# EAGLE design Mega_Shield-v13 (EAGLE 6.1)
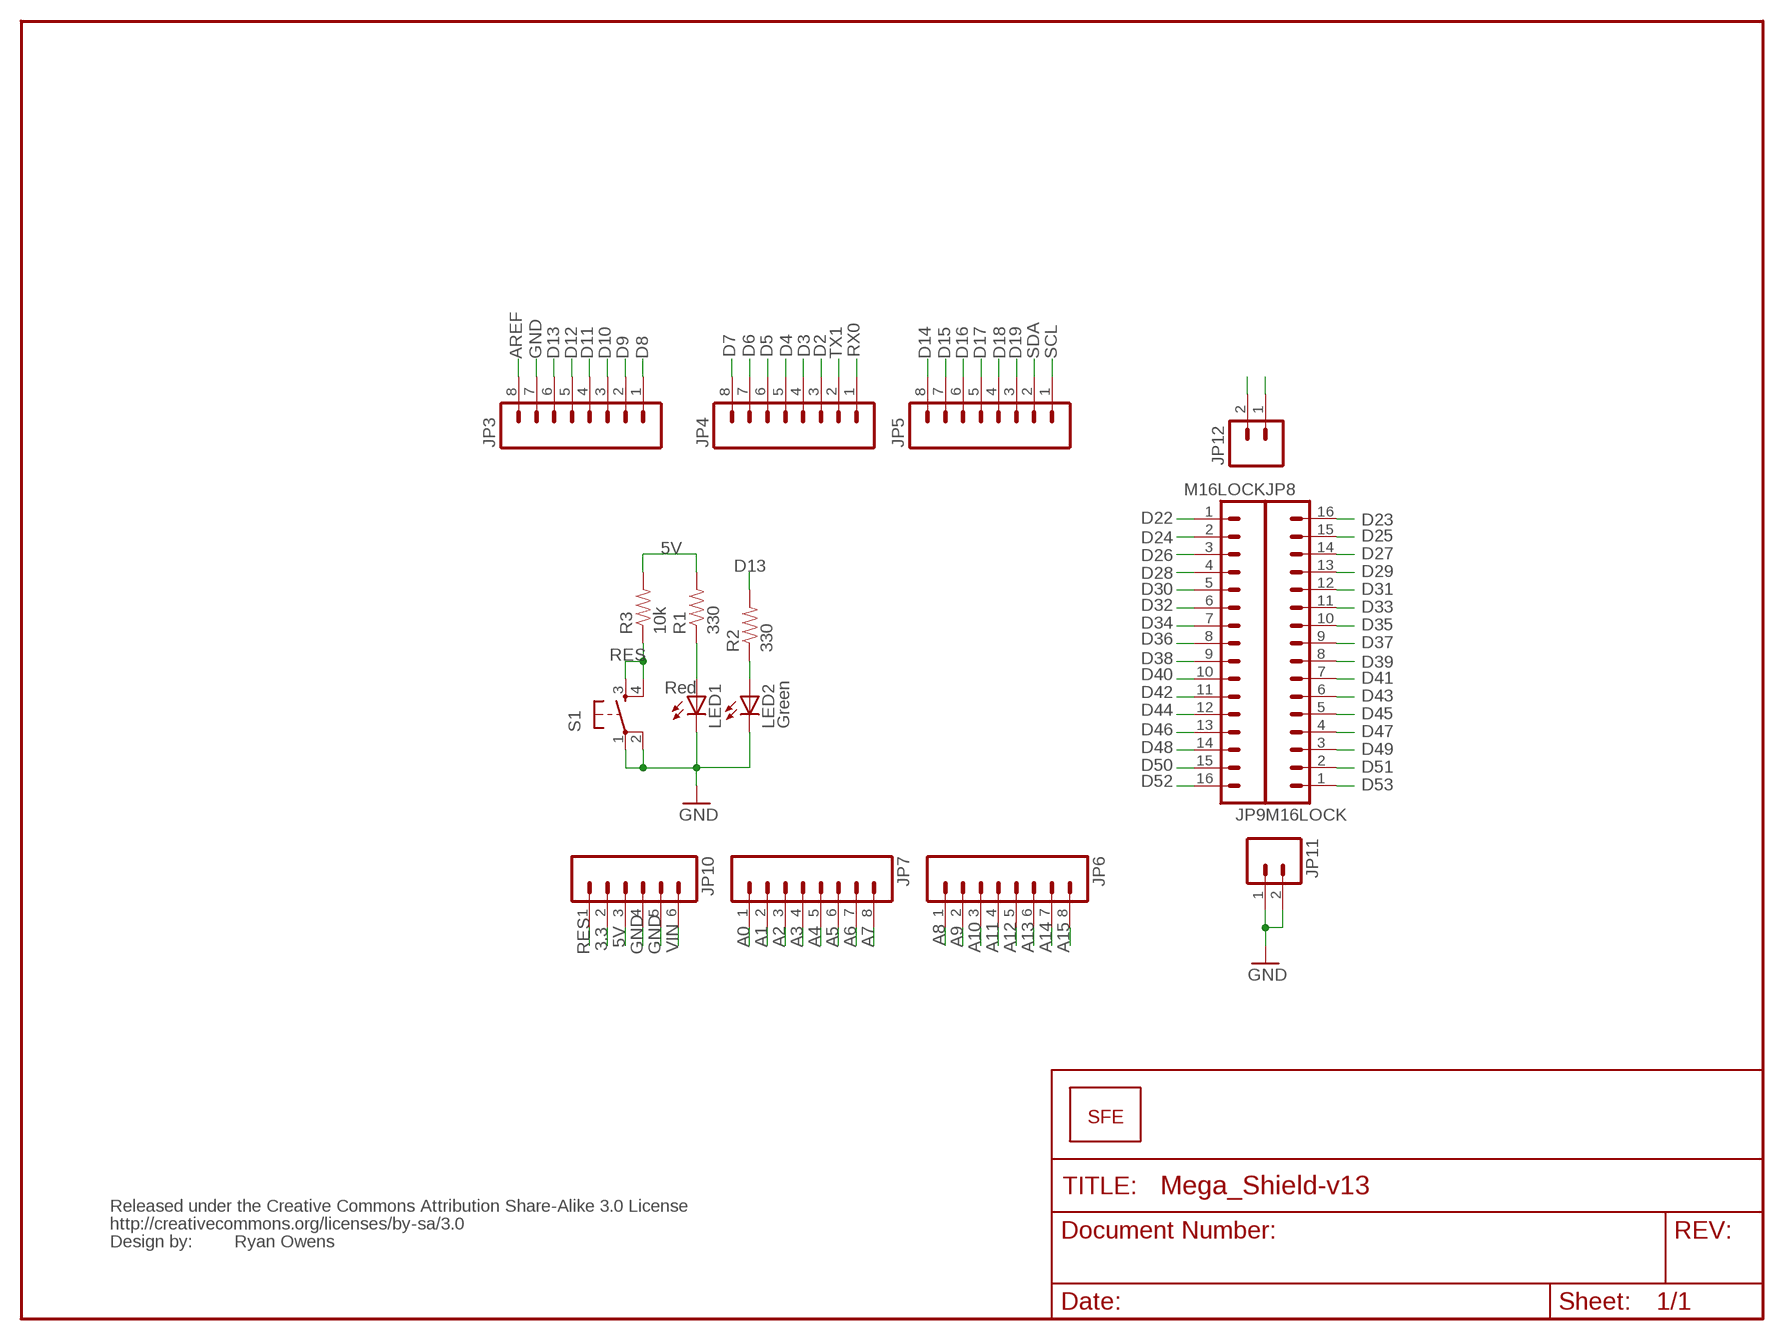
[diagram p0: schematic, sheet 1]

## Parts
JP3  M08LOCK  [1X08_LOCK]
JP4  M08LOCK  [1X08_LOCK]
JP5  M08LOCK  [1X08_LOCK]
JP6  M08LOCK  [1X08_LOCK]
JP7  M08LOCK  [1X08_LOCK]
JP8  M16LOCK  [1X16_LOCK]
JP9  M16LOCK  [1X16_LOCK]
JP10  M06LOCK  [1X06_LOCK]
JP11  M02LOCK  [1X02_LOCK]
JP12  M02LOCK  [1X02_LOCK]
LED1  Red  LED5MM  [LED5MM]
LED2  Green  LED5MM  [LED5MM]
R1  330  RESISTORPTH1  [AXIAL-0.3]
R2  330  RESISTORPTH1  [AXIAL-0.3]
R3  10k  RESISTORPTH1  [AXIAL-0.3]
S1  TAC_SWITCHPTH  [TACTILE-PTH]
U$1  LOGO-SFENEW  [SFE-NEW-WEBLOGO]
U$2  CREATIVE_COMMONS  [CREATIVE_COMMONS]

## Nets
3.3: JP10.2
5V: JP10.3 R1.P$2 R3.P$2
5V@1: JP12.1 JP12.2
A0: JP7.1
A1: JP7.2
A2: JP7.3
A3: JP7.4
A4: JP7.5
A5: JP7.6
A6: JP7.7
A7: JP7.8
A8: JP6.1
A9: JP6.2
A10: JP6.3
A11: JP6.4
A12: JP6.5
A13: JP6.6
A14: JP6.7
A15: JP6.8
AREF: JP3.8
D2: JP4.3
D3: JP4.4
D4: JP4.5
D5: JP4.6
D6: JP4.7
D7: JP4.8
D8: JP3.1
D9: JP3.2
D10: JP3.3
D11: JP3.4
D12: JP3.5
D13: JP3.6 R2.P$2
D14: JP5.8
D15: JP5.7
D16: JP5.6
D17: JP5.5
D18: JP5.4
D19: JP5.3
D22: JP9.1
D23: JP8.16
D24: JP9.2
D25: JP8.15
D26: JP9.3
D27: JP8.14
D28: JP9.4
D29: JP8.13
D30: JP9.5
D31: JP8.12
D32: JP9.6
D33: JP8.11
D34: JP9.7
D35: JP8.10
D36: JP9.8
D37: JP8.9
D38: JP9.9
D39: JP8.8
D40: JP9.10
D41: JP8.7
D42: JP9.11
D43: JP8.6
D44: JP9.12
D45: JP8.5
D46: JP9.13
D47: JP8.4
D48: JP9.14
D49: JP8.3
D50: JP9.15
D51: JP8.2
D52: JP9.16
D53: JP8.1
GND: JP3.7 JP10.4 JP10.5 JP11.1 JP11.2 LED1.K(C) LED2.K(C) S1.1 S1.2
N$126: LED1.A R1.P$1
N$127: LED2.A R2.P$1
RES: JP10.1 R3.P$1 S1.3 S1.4
RX0: JP4.1
SCL: JP5.1
SDA: JP5.2
TX1: JP4.2
VIN: JP10.6

## Notes on the sheet
- Ryan Owens

## Library data of the parts
JP3-JP7 = SparkFun:M08: Header 8 Standard 8-pin 0.1" header. Use with straight break away headers (SKU : PRT-00116), right angle break away headers (PRT-00553), swiss pins (PRT-00743), machine pins (PRT-00117), and female headers (PRT-00115).
JP8 JP9 = SparkFun:M16
JP10 = SparkFun:M06: Header 6 Standard 6-pin 0.1" header. Use with straight break away headers (SKU : PRT-00116), right angle break away headers (PRT-00553), swiss pins (PRT-00743), machine pins (PRT-00117), and female headers (PRT-00115). Molex polarized connector foot print use with SKU : PRT-08094 with associated crimp pins and housings. NOTES ON THE VARIANTS LOCK and LOCK_LONGPADS... This footprint was designed to help hold the alignment of a through-hole component (i.e. 6-pin header) while soldering it into place. You may notice that each hole has been shifted either up or down by 0.005 of an inch from it's more standard position (which is a perfectly straight line). This slight alteration caused the pins (the squares in the middle) to touch the edges of the holes. Because they are alternating, it causes a "brace" to hold the component in place. 0.005 has proven to be the perfect amount of "off-center" position when using our standard breakaway headers. Although looks a little odd when you look at the bare footprint, once you have a header in there, the alteration is very hard to notice. Also, if you push a header all the way into place, it is covered up entirely on the bottom side. This idea of altering the position of holes to aid alignment will be further integrated into the Sparkfun Library for other footprints. It can help hold any component with 3 or more connection pins.
JP11 JP12 = SparkFun:M02: Header 2 Standard 2-pin 0.1" header. Use with straight break away headers (SKU : PRT-00116), right angle break away headers (PRT-00553), swiss pins (PRT-00743), machine pins (PRT-00117), and female headers (PRT-00115). Molex polarized connector foot print use with SKU : PRT-08233 with associated crimp pins and housings.
LED1 LED2 = SparkFun:LED: LEDs Standard schematic elements and footprints for 5mm, 3mm, 1206, and 0603 sized LEDs. 5mm - Spark Fun Electronics SKU : COM-00529 (and others)
R1-R3 = SparkFun:RESISTOR: Resistor Basic schematic elements and footprints for 0603, 1206, and PTH 1/10th watt (small) resistors.
S1 = SparkFun:TAC_SWITCH: Momentary Switch Button commonly used for reset or general input. Spark Fun Electronics SKU : COM-00097
U$1 = SparkFun:LOGO-SFE: Spark Fun Electronics PCB Logo This is the standard Spark Fun Electronics PCB logo.
U$2 = SparkFun:CREATIVE_COMMONS

## Board
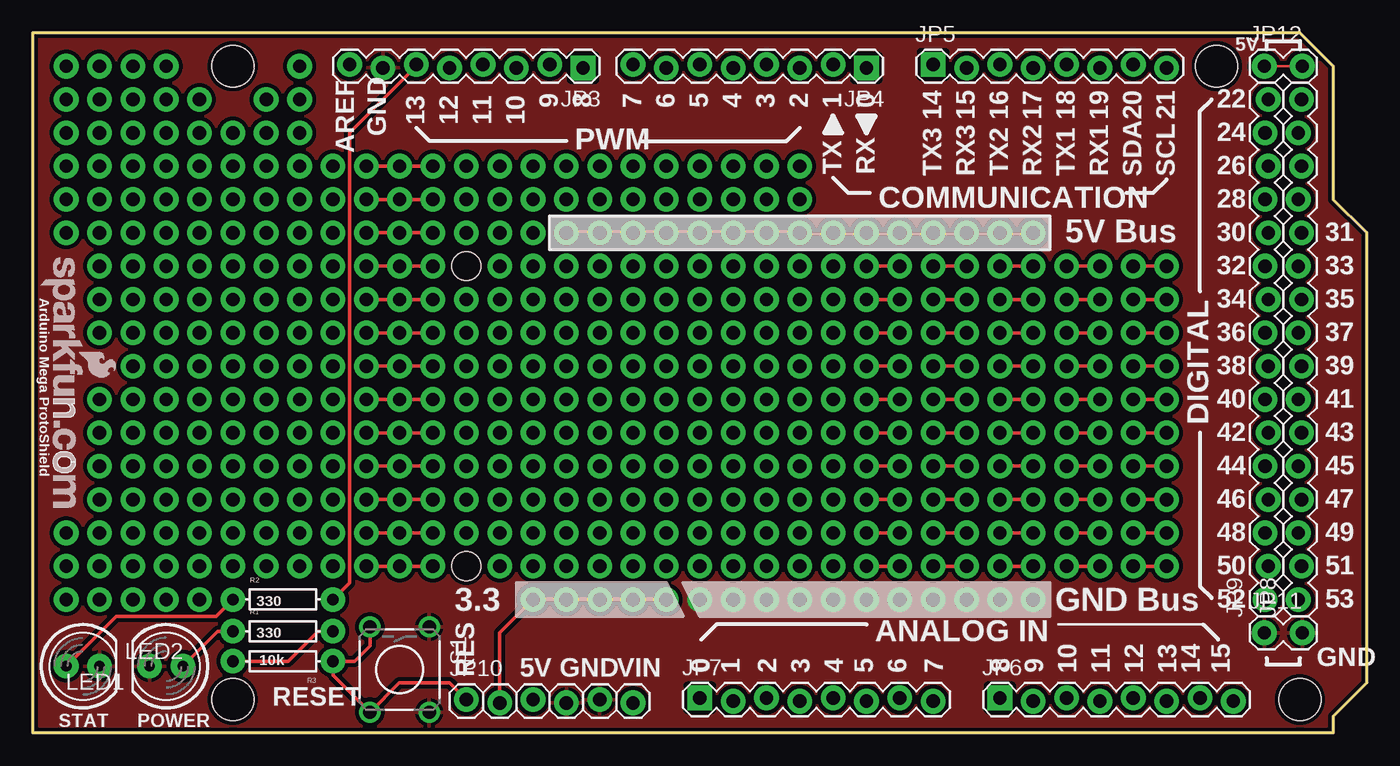
[diagram p1: board, top side]
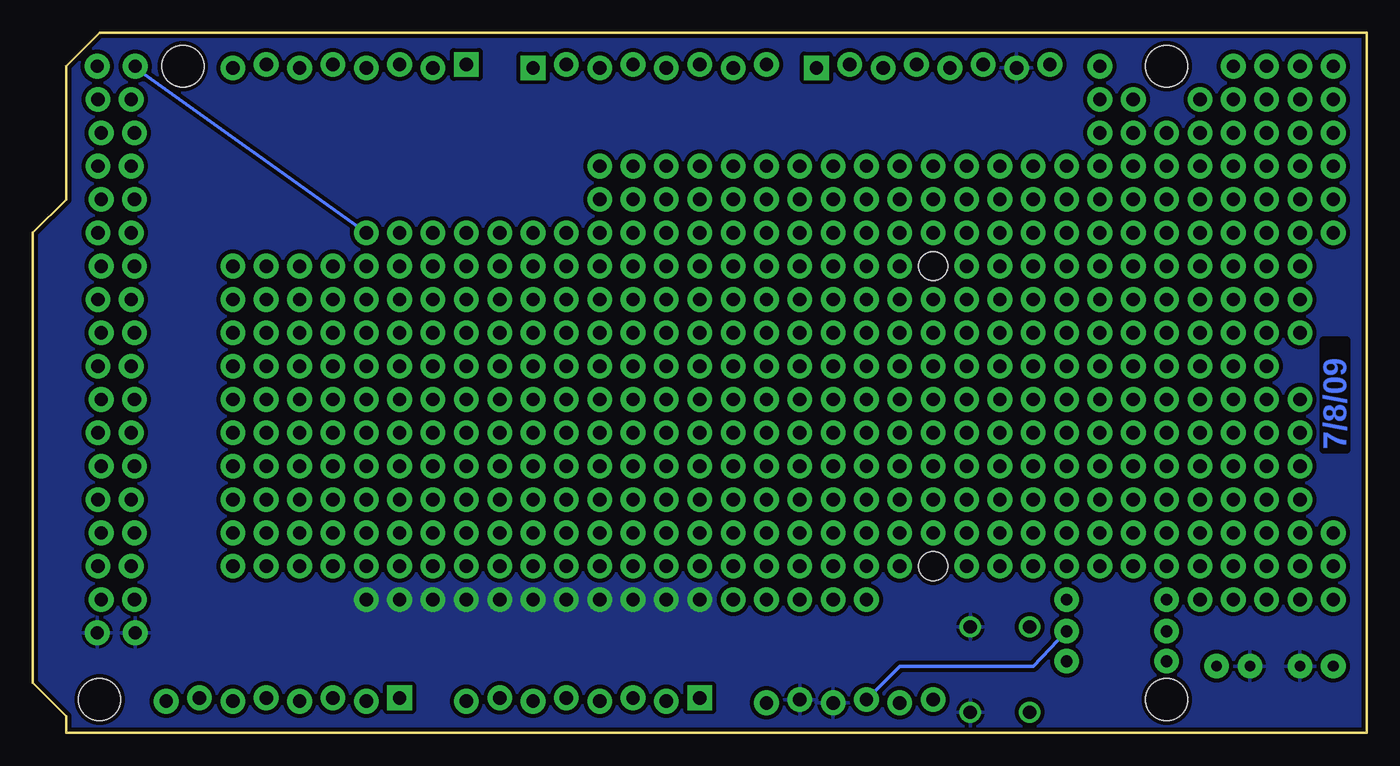
[diagram p2: board, bottom side, seen from below]

Size 101.6 x 53.34 mm. Coordinates in mm from the lower left corner, seen from the top.
Outline: 0,0 99.06,0 99.06,1.27 101.6,3.81 101.6,38.1 99.06,40.64 99.06,50.8 96.52,53.34 0,53.34 0,0
Copper layers (1*16): Top 0.035mm / dielectric 1.5mm / Bottom 0.035mm
Design rules: minimum track width 8mil, minimum drill 20mil, track to track 8mil, track to pad 8mil, pad to pad 8mil, via to via 8mil, smd to smd 8mil, copper to edge 10mil, drill to drill 8mil, minimum pad ring 12mil, minimum via ring 10mil, stop-mask expansion 4mil, vias tented up to drill 25mil, thermal gap 10mil
Holes 3.2 mm at 15.24,50.8 15.24,2.54 90.17,50.8 96.52,2.54
Holes 2.2 mm at 33.02,12.7 33.02,35.56

### Footprints (pad centres in the part's own frame; a part is rotated, then mirrored left to right if it is on the bottom)
1X08_LOCK = drill 1.016 pad 1.88 square: 1 0,0.127 | drill 1.016 pad 1.88: 2 2.54,-0.127; 3 5.08,0.127; 4 7.62,-0.127; 5 10.16,0.127; 6 12.7,-0.127; 7 15.24,0.127; 8 17.78,-0.127
1X16_LOCK = drill 1.016 pad 1.88: 1 0,0.127; 2 2.54,-0.127; 3 5.08,0.127; 4 7.62,-0.127; 5 10.16,0.127; 6 12.7,-0.127; 7 15.24,0.127; 8 17.78,-0.127; 9 20.32,0.127; 10 22.86,-0.127; 11 25.4,0.127; 12 27.94,-0.127; 13 30.48,0.127; 14 33.02,-0.127; 15 35.56,0.127; 16 38.1,-0.127
1X06_LOCK = drill 1.016 pad 1.88: 1 0,0; 2 2.54,-0.254; 3 5.08,0; 4 7.62,-0.254; 5 10.16,0; 6 12.7,-0.254
1X02_LOCK = drill 1.016 pad 1.88: 1 -0.178,0; 2 2.718,0
LED5MM = drill 0.813 pad 1.88: A -1.27,0; K 1.27,0
AXIAL-0.3 = drill 0.9 pad 1.88: P$1 -3.81,0; P$2 3.81,0
TACTILE-PTH = drill 1.016: 1 -3.251,2.261; 2 3.251,2.261; 3 -3.251,-2.261; 4 3.251,-2.261

### Placement (x,y rotation side)
JP3  41.91,50.8 180 top
JP4  63.5,50.8 180 top
JP5  68.58,50.8 0 top
JP6  73.66,2.54 0 top
JP7  50.8,2.54 0 top
JP8  96.52,10.16 90 top
JP9  93.98,10.16 90 top
JP10  33.02,2.54 0 top
JP11  93.98,7.62 0 top
JP12  93.98,50.8 0 top
LED1  10.16,5.08 180 top
LED2  3.81,5.08 0 top
R1  19.05,7.75 0 top
R2  19.05,10.16 0 top
R3  19.05,5.46 180 top
S1  27.94,4.83 270 top
U$1  0.64,36.2 270 top
U$2  20.32,-7.62 0 top  (outside the outline)

### Tracks (layer width: path | path; a pad name or v marks a point on that pad's centre or on a via)
3.3  (via drill 1.02 pad 1.88)
  Top 0.203: JP10.2 35.56,2.54
  Top 0.254: 35.56,2.54 35.56,7.62 v38.1,10.16 v40.64,10.16 v43.18,10.16 v45.72,10.16 v48.26,10.16
5V
  Top 0.254: R3.P$2 19.43,5.46 21.72,7.75 R1.P$2
  Bottom 0.254: R1.P$2 25.4,5.08 35.56,5.08 JP10.3
5V@1  (via drill 1.02 pad 1.88)
  Top 0.203: v76.2,38.1 76.2,38 73.76,38 v73.66,38.1 73.56,38 71.12,38 | 66.04,38 63.6,38 v63.5,38.1 63.4,38 60.96,38 | 66.04,38 68.48,38 v68.58,38.1 68.68,38 71.12,38 | 66.04,38 v66.04,38.1 | 71.12,38 v71.12,38.1 | v40.64,38.1 40.64,38.2 43.08,38.2 v43.18,38.1 43.28,38.2 45.72,38.2 | 50.8,38.2 48.36,38.2 v48.26,38.1 48.16,38.2 45.72,38.2 | 50.8,38.2 53.24,38.2 v53.34,38.1 53.44,38.2 55.88,38.2 | 50.8,38.2 v50.8,38.1 | 55.88,38.2 58.32,38.2 v58.42,38.1 58.52,38 60.96,38 | 55.88,38.2 v55.88,38.1 | 45.72,38.2 v45.72,38.1 | 60.96,38 v60.96,38.1 | JP12.2 JP12.1
  Bottom 0.203: JP12.1 93.88,50.8 93.91,50.75
  Bottom 0.254: v76.2,38.1 93.91,50.75 93.98,50.8
A0
  Top 0.203: JP7.1 50.8,2.54
A1
  Top 0.203: JP7.2 53.34,2.54
A2
  Top 0.203: JP7.3 55.88,2.54
A3
  Top 0.203: JP7.4 58.42,2.54
A4
  Top 0.203: JP7.5 60.96,2.54
A5
  Top 0.203: JP7.6 63.5,2.54
A6
  Top 0.203: JP7.7 66.04,2.54
A7
  Top 0.203: JP7.8 68.58,2.54
A8
  Top 0.203: JP6.1 73.66,2.54
A9
  Top 0.203: JP6.2 76.2,2.54
A10
  Top 0.203: JP6.3 78.74,2.54
A11
  Top 0.203: JP6.4 81.28,2.54
A12
  Top 0.203: JP6.5 83.82,2.54
A13
  Top 0.203: JP6.6 86.36,2.54
A14
  Top 0.203: JP6.7 88.9,2.54
A15
  Top 0.203: JP6.8 91.44,2.54
AREF
  Top 0.203: JP3.8 24.13,50.8
D2
  Top 0.203: JP4.3 58.42,50.8
D3
  Top 0.203: JP4.4 55.88,50.8
D4
  Top 0.203: JP4.5 53.34,50.8
D5
  Top 0.203: JP4.6 50.8,50.8
D6
  Top 0.203: JP4.7 48.26,50.8
D7
  Top 0.203: JP4.8 45.72,50.8
D8
  Top 0.203: JP3.1 41.91,50.8
D9
  Top 0.203: JP3.2 39.37,50.8
D10
  Top 0.203: JP3.3 36.83,50.8
D11
  Top 0.203: JP3.4 34.29,50.8
D12
  Top 0.203: JP3.5 31.75,50.8
D13
  Top 0.254: R2.P$2 24.13,11.43 24.13,45.72 29.21,50.8 JP3.6
D14
  Top 0.203: JP5.8 86.36,50.8
D15
  Top 0.203: JP5.7 83.82,50.8
D16
  Top 0.203: JP5.6 81.28,50.8
D17
  Top 0.203: JP5.5 78.74,50.8
D18
  Top 0.203: JP5.4 76.2,50.8
D19
  Top 0.203: JP5.3 73.66,50.8
GND  (via drill 1.02 pad 1.88)
  other vias: 76.2,10.16 73.66,10.16 71.12,10.16 68.58,10.16 66.04,10.16 63.5,10.16 60.96,10.16 58.42,10.16 55.88,10.16 53.34,10.16 50.8,10.16
  pour Bottom (isolate 0.305): 0,0 99.06,0 99.06,1.27 101.6,3.81 101.6,38.1 99.06,40.64 99.06,50.8 96.52,53.34 0,53.34 0,2.54
  pour Top (isolate 0.305): 0,0 99.06,0 99.06,1.27 101.6,3.81 101.6,38.1 99.06,40.64 99.06,50.8 96.52,53.34 0,53.34 0,2.54
N$1  (via drill 1.02 pad 1.88)
  other vias: 2.54,38.1
N$2  (via drill 1.02 pad 1.88)
  Top 0.254: v86.36,35.56 v83.82,35.56
N$3  (via drill 1.02 pad 1.88)
  Top 0.254: v86.36,33.02 v83.82,33.02
N$4  (via drill 1.02 pad 1.88)
  other vias: 2.54,40.64
N$5  (via drill 1.02 pad 1.88)
  Top 0.254: v86.36,27.94 v83.82,27.94
N$6  (via drill 1.02 pad 1.88)
  other vias: 5.08,40.64
N$7  (via drill 1.02 pad 1.88)
  Top 0.254: v86.36,22.86 v83.82,22.86
N$8  (via drill 1.02 pad 1.88)
  other vias: 7.62,40.64
N$9  (via drill 1.02 pad 1.88)
  Top 0.254: v86.36,17.78 v83.82,17.78
N$10  (via drill 1.02 pad 1.88)
  other vias: 5.08,38.1
N$11  (via drill 1.02 pad 1.88)
  Top 0.254: v86.36,12.7 v83.82,12.7
N$12  (via drill 1.02 pad 1.88)
  Top 0.254: v30.48,12.7 v27.94,12.7 v25.4,12.7
N$13  (via drill 1.02 pad 1.88)
  other vias: 2.54,10.16
N$14  (via drill 1.02 pad 1.88)
  other vias: 7.62,38.1
N$15  (via drill 1.02 pad 1.88)
  other vias: 10.16,38.1
N$16  (via drill 1.02 pad 1.88)
  Top 0.254: v83.82,30.48 v86.36,30.48
N$17  (via drill 1.02 pad 1.88)
  other vias: 12.7,38.1
N$18  (via drill 1.02 pad 1.88)
  Top 0.254: v83.82,25.4 v86.36,25.4
N$19  (via drill 1.02 pad 1.88)
  other vias: 15.24,38.1
N$20  (via drill 1.02 pad 1.88)
  Top 0.254: v83.82,20.32 v86.36,20.32
N$21  (via drill 1.02 pad 1.88)
  other vias: 17.78,38.1
N$22  (via drill 1.02 pad 1.88)
  Top 0.254: v83.82,15.24 v86.36,15.24
N$23  (via drill 1.02 pad 1.88)
  other vias: 20.32,38.1
N$24  (via drill 1.02 pad 1.88)
  other vias: 5.08,10.16
N$25  (via drill 1.02 pad 1.88)
  other vias: 7.62,10.16
N$26  (via drill 1.02 pad 1.88)
  Top 0.254: v81.28,12.7 v78.74,12.7
N$27  (via drill 1.02 pad 1.88)
  Top 0.254: v81.28,15.24 v78.74,15.24
N$28  (via drill 1.02 pad 1.88)
  Top 0.254: v81.28,17.78 v78.74,17.78
N$29  (via drill 1.02 pad 1.88)
  Top 0.254: v81.28,20.32 v78.74,20.32
N$30  (via drill 1.02 pad 1.88)
  Top 0.254: v81.28,22.86 v78.74,22.86
N$31  (via drill 1.02 pad 1.88)
  Top 0.254: v81.28,25.4 v78.74,25.4
N$32  (via drill 1.02 pad 1.88)
  Top 0.254: v81.28,27.94 v78.74,27.94
N$33  (via drill 1.02 pad 1.88)
  Top 0.254: v81.28,30.48 v78.74,30.48
N$34  (via drill 1.02 pad 1.88)
  Top 0.254: v81.28,33.02 v78.74,33.02
N$35  (via drill 1.02 pad 1.88)
  Top 0.254: v81.28,35.56 v78.74,35.56
N$36  (via drill 1.02 pad 1.88)
  other vias: 10.16,10.16
N$37  (via drill 1.02 pad 1.88)
  other vias: 12.7,10.16
N$38  (via drill 1.02 pad 1.88)
  other vias: 22.86,38.1
N$39  (via drill 1.02 pad 1.88)
  Top 0.254: v25.4,38.1 v27.94,38.1 v30.48,38.1
N$42  (via drill 1.02 pad 1.88)
  other vias: 33.02,38.1
N$43  (via drill 1.02 pad 1.88)
  other vias: 35.56,38.1
N$44  (via drill 1.02 pad 1.88)
  other vias: 38.1,38.1
N$45  (via drill 1.02 pad 1.88)
  other vias: 45.72,35.56
N$46  (via drill 1.02 pad 1.88)
  other vias: 48.26,35.56
N$47  (via drill 1.02 pad 1.88)
  other vias: 50.8,35.56
N$48  (via drill 1.02 pad 1.88)
  other vias: 53.34,35.56
N$49  (via drill 1.02 pad 1.88)
  other vias: 55.88,35.56
N$50  (via drill 1.02 pad 1.88)
  Top 0.254: v76.2,12.7 v73.66,12.7
N$51  (via drill 1.02 pad 1.88)
  Top 0.254: v76.2,15.24 v73.66,15.24
N$52  (via drill 1.02 pad 1.88)
  Top 0.254: v76.2,17.78 v73.66,17.78
N$53  (via drill 1.02 pad 1.88)
  Top 0.254: v76.2,20.32 v73.66,20.32
N$54  (via drill 1.02 pad 1.88)
  Top 0.254: v76.2,22.86 v73.66,22.86
N$55  (via drill 1.02 pad 1.88)
  Top 0.254: v76.2,25.4 v73.66,25.4
N$56  (via drill 1.02 pad 1.88)
  Top 0.254: v76.2,27.94 v73.66,27.94
N$57  (via drill 1.02 pad 1.88)
  Top 0.254: v76.2,30.48 v73.66,30.48
N$58  (via drill 1.02 pad 1.88)
  Top 0.254: v76.2,33.02 v73.66,33.02
N$59  (via drill 1.02 pad 1.88)
  other vias: 58.42,35.56
N$60  (via drill 1.02 pad 1.88)
  other vias: 60.96,35.56
N$61  (via drill 1.02 pad 1.88)
  other vias: 35.56,12.7
N$62  (via drill 1.02 pad 1.88)
  Top 0.254: v66.04,35.56 v63.5,35.56
N$64  (via drill 1.02 pad 1.88)
  Top 0.254: v71.12,35.56 v68.58,35.56
N$66  (via drill 1.02 pad 1.88)
  Top 0.254: v76.2,35.56 v73.66,35.56
N$74  (via drill 1.02 pad 1.88)
  Top 0.254: v71.12,12.7 v68.58,12.7
N$76  (via drill 1.02 pad 1.88)
  Top 0.254: v71.12,17.78 v68.58,17.78
N$78  (via drill 1.02 pad 1.88)
  Top 0.254: v71.12,22.86 v68.58,22.86
N$80  (via drill 1.02 pad 1.88)
  Top 0.254: v71.12,27.94 v68.58,27.94
N$82  (via drill 1.02 pad 1.88)
  Top 0.254: v71.12,33.02 v68.58,33.02
N$88  (via drill 1.02 pad 1.88)
  Top 0.254: v68.58,30.48 v71.12,30.48
N$90  (via drill 1.02 pad 1.88)
  Top 0.254: v68.58,25.4 v71.12,25.4
N$92  (via drill 1.02 pad 1.88)
  Top 0.254: v68.58,20.32 v71.12,20.32
N$94  (via drill 1.02 pad 1.88)
  Top 0.254: v68.58,15.24 v71.12,15.24
N$98  (via drill 1.02 pad 1.88)
  Top 0.254: v66.04,12.7 v63.5,12.7
N$100  (via drill 1.02 pad 1.88)
  Top 0.254: v66.04,17.78 v63.5,17.78
N$102  (via drill 1.02 pad 1.88)
  Top 0.254: v66.04,22.86 v63.5,22.86
N$104  (via drill 1.02 pad 1.88)
  Top 0.254: v66.04,27.94 v63.5,27.94
N$106  (via drill 1.02 pad 1.88)
  Top 0.254: v66.04,33.02 v63.5,33.02
N$112  (via drill 1.02 pad 1.88)
  Top 0.254: v63.5,30.48 v66.04,30.48
N$114  (via drill 1.02 pad 1.88)
  Top 0.254: v63.5,25.4 v66.04,25.4
N$116  (via drill 1.02 pad 1.88)
  Top 0.254: v63.5,20.32 v66.04,20.32
N$118  (via drill 1.02 pad 1.88)
  Top 0.254: v63.5,15.24 v66.04,15.24
N$122  (via drill 1.02 pad 1.88)
  other vias: 60.96,12.7
N$123  (via drill 1.02 pad 1.88)
  other vias: 60.96,15.24
N$124  (via drill 1.02 pad 1.88)
  other vias: 60.96,17.78
N$126
  Top 0.254: R1.P$1 14.1,7.75 LED1.A
N$127
  Top 0.254: R2.P$1 13.97,8.89 6.35,8.89 LED2.A
N$128  (via drill 1.02 pad 1.88)
  other vias: 60.96,20.32
N$129  (via drill 1.02 pad 1.88)
  other vias: 60.96,22.86
N$130  (via drill 1.02 pad 1.88)
  other vias: 60.96,25.4
N$131  (via drill 1.02 pad 1.88)
  other vias: 60.96,27.94
N$132  (via drill 1.02 pad 1.88)
  other vias: 60.96,30.48
N$133  (via drill 1.02 pad 1.88)
  other vias: 60.96,33.02
N$136  (via drill 1.02 pad 1.88)
  other vias: 58.42,43.18
N$137  (via drill 1.02 pad 1.88)
  other vias: 58.42,40.64
N$140  (via drill 1.02 pad 1.88)
  other vias: 58.42,33.02
N$141  (via drill 1.02 pad 1.88)
  other vias: 58.42,30.48
N$142  (via drill 1.02 pad 1.88)
  other vias: 58.42,27.94
N$143  (via drill 1.02 pad 1.88)
  other vias: 58.42,25.4
N$144  (via drill 1.02 pad 1.88)
  other vias: 58.42,22.86
N$145  (via drill 1.02 pad 1.88)
  other vias: 58.42,20.32
N$146  (via drill 1.02 pad 1.88)
  other vias: 58.42,17.78
N$147  (via drill 1.02 pad 1.88)
  other vias: 58.42,15.24
N$148  (via drill 1.02 pad 1.88)
  other vias: 58.42,12.7
N$151  (via drill 1.02 pad 1.88)
  other vias: 55.88,12.7
N$152  (via drill 1.02 pad 1.88)
  other vias: 55.88,15.24
N$153  (via drill 1.02 pad 1.88)
  other vias: 55.88,17.78
N$154  (via drill 1.02 pad 1.88)
  other vias: 55.88,20.32
N$155  (via drill 1.02 pad 1.88)
  other vias: 55.88,22.86
N$156  (via drill 1.02 pad 1.88)
  other vias: 55.88,25.4
N$157  (via drill 1.02 pad 1.88)
  other vias: 55.88,27.94
N$158  (via drill 1.02 pad 1.88)
  other vias: 55.88,30.48
N$159  (via drill 1.02 pad 1.88)
  other vias: 55.88,33.02
N$162  (via drill 1.02 pad 1.88)
  other vias: 55.88,40.64
N$163  (via drill 1.02 pad 1.88)
  other vias: 55.88,43.18
N$164  (via drill 1.02 pad 1.88)
  other vias: 53.34,43.18
N$165  (via drill 1.02 pad 1.88)
  other vias: 53.34,40.64
N$168  (via drill 1.02 pad 1.88)
  other vias: 53.34,33.02
N$169  (via drill 1.02 pad 1.88)
  other vias: 53.34,30.48
N$170  (via drill 1.02 pad 1.88)
  other vias: 53.34,27.94
N$171  (via drill 1.02 pad 1.88)
  other vias: 53.34,25.4
N$172  (via drill 1.02 pad 1.88)
  other vias: 53.34,22.86
N$173  (via drill 1.02 pad 1.88)
  other vias: 53.34,20.32
N$174  (via drill 1.02 pad 1.88)
  other vias: 53.34,17.78
N$175  (via drill 1.02 pad 1.88)
  other vias: 53.34,15.24
N$176  (via drill 1.02 pad 1.88)
  other vias: 53.34,12.7
N$179  (via drill 1.02 pad 1.88)
  other vias: 50.8,12.7
N$180  (via drill 1.02 pad 1.88)
  other vias: 50.8,15.24
N$181  (via drill 1.02 pad 1.88)
  other vias: 50.8,17.78
N$182  (via drill 1.02 pad 1.88)
  other vias: 50.8,20.32
N$183  (via drill 1.02 pad 1.88)
  other vias: 50.8,22.86
N$184  (via drill 1.02 pad 1.88)
  other vias: 50.8,25.4
N$185  (via drill 1.02 pad 1.88)
  other vias: 50.8,27.94
N$186  (via drill 1.02 pad 1.88)
  other vias: 50.8,30.48
N$187  (via drill 1.02 pad 1.88)
  other vias: 50.8,33.02
N$190  (via drill 1.02 pad 1.88)
  other vias: 50.8,40.64
N$191  (via drill 1.02 pad 1.88)
  other vias: 50.8,43.18
N$192  (via drill 1.02 pad 1.88)
  other vias: 48.26,43.18
N$193  (via drill 1.02 pad 1.88)
  other vias: 48.26,40.64
N$196  (via drill 1.02 pad 1.88)
  other vias: 48.26,33.02
N$197  (via drill 1.02 pad 1.88)
  other vias: 48.26,30.48
N$198  (via drill 1.02 pad 1.88)
  other vias: 48.26,27.94
N$199  (via drill 1.02 pad 1.88)
  other vias: 48.26,25.4
N$200  (via drill 1.02 pad 1.88)
  other vias: 48.26,22.86
N$201  (via drill 1.02 pad 1.88)
  other vias: 48.26,20.32
N$202  (via drill 1.02 pad 1.88)
  other vias: 48.26,17.78
N$203  (via drill 1.02 pad 1.88)
  other vias: 48.26,15.24
N$204  (via drill 1.02 pad 1.88)
  other vias: 48.26,12.7
N$207  (via drill 1.02 pad 1.88)
  other vias: 45.72,12.7
N$208  (via drill 1.02 pad 1.88)
  other vias: 45.72,15.24
N$209  (via drill 1.02 pad 1.88)
  other vias: 45.72,17.78
N$210  (via drill 1.02 pad 1.88)
  other vias: 45.72,20.32
N$211  (via drill 1.02 pad 1.88)
  other vias: 45.72,22.86
N$212  (via drill 1.02 pad 1.88)
  other vias: 45.72,25.4
N$213  (via drill 1.02 pad 1.88)
  other vias: 45.72,27.94
N$214  (via drill 1.02 pad 1.88)
  other vias: 45.72,30.48
N$215  (via drill 1.02 pad 1.88)
  other vias: 45.72,33.02
N$218  (via drill 1.02 pad 1.88)
  other vias: 45.72,40.64
N$219  (via drill 1.02 pad 1.88)
  other vias: 45.72,43.18
N$220  (via drill 1.02 pad 1.88)
  other vias: 43.18,43.18
N$221  (via drill 1.02 pad 1.88)
  other vias: 43.18,40.64
N$223  (via drill 1.02 pad 1.88)
  other vias: 43.18,35.56
N$224  (via drill 1.02 pad 1.88)
  other vias: 43.18,33.02
N$225  (via drill 1.02 pad 1.88)
  other vias: 43.18,30.48
N$226  (via drill 1.02 pad 1.88)
  other vias: 43.18,27.94
N$227  (via drill 1.02 pad 1.88)
  other vias: 43.18,25.4
N$228  (via drill 1.02 pad 1.88)
  other vias: 43.18,22.86
N$229  (via drill 1.02 pad 1.88)
  other vias: 43.18,20.32
N$230  (via drill 1.02 pad 1.88)
  other vias: 43.18,17.78
N$231  (via drill 1.02 pad 1.88)
  other vias: 43.18,15.24
N$232  (via drill 1.02 pad 1.88)
  other vias: 43.18,12.7
N$235  (via drill 1.02 pad 1.88)
  other vias: 40.64,12.7
N$236  (via drill 1.02 pad 1.88)
  other vias: 40.64,15.24
N$237  (via drill 1.02 pad 1.88)
  other vias: 40.64,17.78
N$238  (via drill 1.02 pad 1.88)
  other vias: 40.64,20.32
N$239  (via drill 1.02 pad 1.88)
  other vias: 40.64,22.86
N$240  (via drill 1.02 pad 1.88)
  other vias: 40.64,25.4
N$241  (via drill 1.02 pad 1.88)
  other vias: 40.64,27.94
N$242  (via drill 1.02 pad 1.88)
  other vias: 40.64,30.48
N$243  (via drill 1.02 pad 1.88)
  other vias: 40.64,33.02
N$244  (via drill 1.02 pad 1.88)
  other vias: 40.64,35.56
N$246  (via drill 1.02 pad 1.88)
  other vias: 40.64,40.64
N$247  (via drill 1.02 pad 1.88)
  other vias: 40.64,43.18
N$248  (via drill 1.02 pad 1.88)
  other vias: 38.1,43.18
N$249  (via drill 1.02 pad 1.88)
  other vias: 38.1,40.64
N$251  (via drill 1.02 pad 1.88)
  other vias: 38.1,35.56
N$252  (via drill 1.02 pad 1.88)
  other vias: 38.1,33.02
N$253  (via drill 1.02 pad 1.88)
  other vias: 38.1,30.48
N$254  (via drill 1.02 pad 1.88)
  other vias: 38.1,27.94
N$255  (via drill 1.02 pad 1.88)
  other vias: 38.1,25.4
N$256  (via drill 1.02 pad 1.88)
  other vias: 38.1,22.86
N$257  (via drill 1.02 pad 1.88)
  other vias: 38.1,20.32
N$258  (via drill 1.02 pad 1.88)
  other vias: 38.1,17.78
N$259  (via drill 1.02 pad 1.88)
  other vias: 38.1,15.24
N$260  (via drill 1.02 pad 1.88)
  other vias: 38.1,12.7
N$264  (via drill 1.02 pad 1.88)
  other vias: 35.56,15.24
N$265  (via drill 1.02 pad 1.88)
  other vias: 35.56,17.78
N$266  (via drill 1.02 pad 1.88)
  other vias: 35.56,20.32
N$267  (via drill 1.02 pad 1.88)
  other vias: 35.56,22.86
N$268  (via drill 1.02 pad 1.88)
  other vias: 35.56,25.4
N$269  (via drill 1.02 pad 1.88)
  other vias: 35.56,27.94
N$270  (via drill 1.02 pad 1.88)
  other vias: 35.56,30.48
N$271  (via drill 1.02 pad 1.88)
  other vias: 35.56,33.02
N$272  (via drill 1.02 pad 1.88)
  other vias: 35.56,35.56
N$274  (via drill 1.02 pad 1.88)
  other vias: 35.56,40.64
N$275  (via drill 1.02 pad 1.88)
  other vias: 35.56,43.18
N$276  (via drill 1.02 pad 1.88)
  other vias: 33.02,43.18
N$277  (via drill 1.02 pad 1.88)
  other vias: 33.02,40.64
N$280  (via drill 1.02 pad 1.88)
  other vias: 33.02,33.02
N$281  (via drill 1.02 pad 1.88)
  other vias: 33.02,30.48
N$282  (via drill 1.02 pad 1.88)
  other vias: 33.02,27.94
N$283  (via drill 1.02 pad 1.88)
  other vias: 33.02,22.86
N$284  (via drill 1.02 pad 1.88)
  other vias: 33.02,25.4
N$285  (via drill 1.02 pad 1.88)
  other vias: 33.02,20.32
N$286  (via drill 1.02 pad 1.88)
  other vias: 33.02,17.78
N$287  (via drill 1.02 pad 1.88)
  other vias: 33.02,15.24
N$293  (via drill 1.02 pad 1.88)
  Top 0.254: v30.48,17.78 v27.94,17.78 v25.4,17.78
N$295  (via drill 1.02 pad 1.88)
  Top 0.254: v30.48,22.86 v27.94,22.86 v25.4,22.86
N$297  (via drill 1.02 pad 1.88)
  Top 0.254: v30.48,27.94 v27.94,27.94 v25.4,27.94
N$326  (via drill 1.02 pad 1.88)
  Top 0.254: v25.4,43.18 v27.94,43.18 v30.48,43.18
N$327  (via drill 1.02 pad 1.88)
  Top 0.254: v25.4,40.64 v27.94,40.64 v30.48,40.64
N$329  (via drill 1.02 pad 1.88)
  Top 0.254: v25.4,35.56 v27.94,35.56 v30.48,35.56
N$330  (via drill 1.02 pad 1.88)
  Top 0.254: v25.4,33.02 v27.94,33.02 v30.48,33.02
N$331  (via drill 1.02 pad 1.88)
  Top 0.254: v25.4,30.48 v27.94,30.48 v30.48,30.48
N$333  (via drill 1.02 pad 1.88)
  Top 0.254: v25.4,25.4 v27.94,25.4 v30.48,25.4
N$335  (via drill 1.02 pad 1.88)
  Top 0.254: v25.4,20.32 v27.94,20.32 v30.48,20.32
N$337  (via drill 1.02 pad 1.88)
  Top 0.254: v25.4,15.24 v27.94,15.24 v30.48,15.24
N$343  (via drill 1.02 pad 1.88)
  other vias: 22.86,12.7
N$344  (via drill 1.02 pad 1.88)
  other vias: 22.86,15.24
N$345  (via drill 1.02 pad 1.88)
  other vias: 22.86,17.78
N$346  (via drill 1.02 pad 1.88)
  other vias: 22.86,20.32
N$347  (via drill 1.02 pad 1.88)
  other vias: 22.86,22.86
N$348  (via drill 1.02 pad 1.88)
  other vias: 22.86,25.4
N$349  (via drill 1.02 pad 1.88)
  other vias: 22.86,27.94
N$350  (via drill 1.02 pad 1.88)
  other vias: 22.86,30.48
N$351  (via drill 1.02 pad 1.88)
  other vias: 22.86,33.02
N$352  (via drill 1.02 pad 1.88)
  other vias: 22.86,35.56
N$354  (via drill 1.02 pad 1.88)
  other vias: 22.86,40.64
N$355  (via drill 1.02 pad 1.88)
  other vias: 22.86,43.18
N$356  (via drill 1.02 pad 1.88)
  other vias: 20.32,45.72
N$357  (via drill 1.02 pad 1.88)
  other vias: 20.32,48.26
N$358  (via drill 1.02 pad 1.88)
  other vias: 20.32,50.8
N$359  (via drill 1.02 pad 1.88)
  other vias: 20.32,43.18
N$360  (via drill 1.02 pad 1.88)
  other vias: 20.32,40.64
N$362  (via drill 1.02 pad 1.88)
  other vias: 20.32,35.56
N$363  (via drill 1.02 pad 1.88)
  other vias: 20.32,33.02
N$364  (via drill 1.02 pad 1.88)
  other vias: 20.32,30.48
N$365  (via drill 1.02 pad 1.88)
  other vias: 20.32,27.94
N$366  (via drill 1.02 pad 1.88)
  other vias: 20.32,22.86
N$367  (via drill 1.02 pad 1.88)
  other vias: 20.32,25.4
N$368  (via drill 1.02 pad 1.88)
  other vias: 20.32,20.32
N$369  (via drill 1.02 pad 1.88)
  other vias: 20.32,17.78
N$370  (via drill 1.02 pad 1.88)
  other vias: 20.32,15.24
N$371  (via drill 1.02 pad 1.88)
  other vias: 20.32,12.7
N$376  (via drill 1.02 pad 1.88)
  other vias: 17.78,12.7
N$377  (via drill 1.02 pad 1.88)
  other vias: 17.78,15.24
N$378  (via drill 1.02 pad 1.88)
  other vias: 17.78,17.78
N$379  (via drill 1.02 pad 1.88)
  other vias: 17.78,20.32
N$380  (via drill 1.02 pad 1.88)
  other vias: 17.78,22.86
N$381  (via drill 1.02 pad 1.88)
  other vias: 17.78,25.4
N$382  (via drill 1.02 pad 1.88)
  other vias: 17.78,27.94
N$383  (via drill 1.02 pad 1.88)
  other vias: 17.78,30.48
N$384  (via drill 1.02 pad 1.88)
  other vias: 17.78,33.02
N$385  (via drill 1.02 pad 1.88)
  other vias: 17.78,35.56
N$387  (via drill 1.02 pad 1.88)
  other vias: 17.78,40.64
N$388  (via drill 1.02 pad 1.88)
  other vias: 17.78,43.18
N$389  (via drill 1.02 pad 1.88)
  other vias: 17.78,45.72
N$390  (via drill 1.02 pad 1.88)
  other vias: 15.24,45.72
N$391  (via drill 1.02 pad 1.88)
  other vias: 12.7,45.72
N$392  (via drill 1.02 pad 1.88)
  other vias: 10.16,45.72
N$393  (via drill 1.02 pad 1.88)
  other vias: 7.62,45.72
N$394  (via drill 1.02 pad 1.88)
  other vias: 5.08,45.72
N$395  (via drill 1.02 pad 1.88)
  other vias: 5.08,43.18
N$398  (via drill 1.02 pad 1.88)
  other vias: 5.08,35.56
N$399  (via drill 1.02 pad 1.88)
  other vias: 5.08,33.02
N$400  (via drill 1.02 pad 1.88)
  other vias: 5.08,30.48
N$401  (via drill 1.02 pad 1.88)
  other vias: 7.62,30.48
N$402  (via drill 1.02 pad 1.88)
  other vias: 7.62,33.02
N$403  (via drill 1.02 pad 1.88)
  other vias: 7.62,35.56
N$406  (via drill 1.02 pad 1.88)
  other vias: 7.62,43.18
N$407  (via drill 1.02 pad 1.88)
  other vias: 10.16,43.18
N$408  (via drill 1.02 pad 1.88)
  other vias: 10.16,40.64
N$410  (via drill 1.02 pad 1.88)
  other vias: 10.16,35.56
N$411  (via drill 1.02 pad 1.88)
  other vias: 10.16,33.02
N$412  (via drill 1.02 pad 1.88)
  other vias: 10.16,30.48
N$413  (via drill 1.02 pad 1.88)
  other vias: 12.7,30.48
N$414  (via drill 1.02 pad 1.88)
  other vias: 12.7,33.02
N$415  (via drill 1.02 pad 1.88)
  other vias: 12.7,35.56
N$417  (via drill 1.02 pad 1.88)
  other vias: 12.7,40.64
N$418  (via drill 1.02 pad 1.88)
  other vias: 12.7,43.18
N$419  (via drill 1.02 pad 1.88)
  other vias: 15.24,43.18
N$420  (via drill 1.02 pad 1.88)
  other vias: 15.24,40.64
N$422  (via drill 1.02 pad 1.88)
  other vias: 15.24,35.56
N$423  (via drill 1.02 pad 1.88)
  other vias: 15.24,33.02
N$424  (via drill 1.02 pad 1.88)
  other vias: 15.24,30.48
N$425  (via drill 1.02 pad 1.88)
  other vias: 15.24,27.94
N$426  (via drill 1.02 pad 1.88)
  other vias: 15.24,25.4
N$427  (via drill 1.02 pad 1.88)
  other vias: 15.24,22.86
N$428  (via drill 1.02 pad 1.88)
  other vias: 15.24,20.32
N$429  (via drill 1.02 pad 1.88)
  other vias: 15.24,17.78
N$430  (via drill 1.02 pad 1.88)
  other vias: 15.24,12.7
N$431  (via drill 1.02 pad 1.88)
  other vias: 15.24,15.24
N$436  (via drill 1.02 pad 1.88)
  other vias: 12.7,12.7
N$437  (via drill 1.02 pad 1.88)
  other vias: 12.7,15.24
N$438  (via drill 1.02 pad 1.88)
  other vias: 12.7,20.32
N$439  (via drill 1.02 pad 1.88)
  other vias: 12.7,17.78
N$440  (via drill 1.02 pad 1.88)
  other vias: 12.7,22.86
N$441  (via drill 1.02 pad 1.88)
  other vias: 12.7,25.4
N$442  (via drill 1.02 pad 1.88)
  other vias: 12.7,27.94
N$443  (via drill 1.02 pad 1.88)
  other vias: 10.16,27.94
N$444  (via drill 1.02 pad 1.88)
  other vias: 7.62,25.4
N$445  (via drill 1.02 pad 1.88)
  other vias: 10.16,25.4
N$446  (via drill 1.02 pad 1.88)
  other vias: 10.16,22.86
N$447  (via drill 1.02 pad 1.88)
  other vias: 7.62,22.86
N$448  (via drill 1.02 pad 1.88)
  other vias: 5.08,22.86
N$449  (via drill 1.02 pad 1.88)
  other vias: 5.08,20.32
N$450  (via drill 1.02 pad 1.88)
  other vias: 5.08,17.78
N$451  (via drill 1.02 pad 1.88)
  other vias: 5.08,15.24
N$452  (via drill 1.02 pad 1.88)
  other vias: 5.08,12.7
N$460  (via drill 1.02 pad 1.88)
  other vias: 10.16,12.7
N$461  (via drill 1.02 pad 1.88)
  other vias: 10.16,15.24
N$462  (via drill 1.02 pad 1.88)
  other vias: 10.16,17.78
N$463  (via drill 1.02 pad 1.88)
  other vias: 10.16,20.32
N$464  (via drill 1.02 pad 1.88)
  other vias: 7.62,20.32
N$465  (via drill 1.02 pad 1.88)
  other vias: 7.62,17.78
N$466  (via drill 1.02 pad 1.88)
  other vias: 7.62,12.7
N$467  (via drill 1.02 pad 1.88)
  other vias: 7.62,15.24
N$477  (via drill 1.02 pad 1.88)
  other vias: 12.7,48.26
N$478  (via drill 1.02 pad 1.88)
  other vias: 10.16,48.26
N$479  (via drill 1.02 pad 1.88)
  other vias: 7.62,48.26
N$480  (via drill 1.02 pad 1.88)
  other vias: 5.08,48.26
N$481  (via drill 1.02 pad 1.88)
  other vias: 5.08,50.8
N$482  (via drill 1.02 pad 1.88)
  other vias: 7.62,50.8
N$483  (via drill 1.02 pad 1.88)
  other vias: 10.16,50.8
N$484  (via drill 1.02 pad 1.88)
  other vias: 17.78,48.26
N$492  (via drill 1.02 pad 1.88)
  other vias: 2.54,12.7
N$493  (via drill 1.02 pad 1.88)
  other vias: 2.54,15.24
N$495  (via drill 1.02 pad 1.88)
  other vias: 2.54,43.18
N$497  (via drill 1.02 pad 1.88)
  other vias: 2.54,45.72
N$498  (via drill 1.02 pad 1.88)
  other vias: 2.54,48.26
N$499  (via drill 1.02 pad 1.88)
  other vias: 2.54,50.8
N$500  (via drill 1.02 pad 1.88)
  other vias: 7.62,27.94
N$501  (via drill 1.02 pad 1.88)
  other vias: 5.08,25.4
RES
  Top 0.254: JP10.1 31.75,3.81 27.91,3.81 S1.4 22.86,4.39 R3.P$1 24.51,5.46 25.68,6.63 S1.3
RX0
  Top 0.203: JP4.1 63.5,50.8
SCL
  Top 0.203: JP5.1 68.58,50.8
SDA
  Top 0.203: JP5.2 71.12,50.8
TX1
  Top 0.203: JP4.2 60.96,50.8
VIN
  Top 0.203: JP10.6 45.72,2.54

### Text on the board
Bottom: 7/8/09
tPlace: 5V | 9 | 8 | 7 | 6 | 5 | 4 | 3 | 2 | 1 | 0 | 22 | 14 | 15 | 16 | 17 | 18 | 19 | 20 | 21 | 13 | 12 | 11 | 10 | GND | 24 | AREF | PWM | TX | RX | 26 | TX3 | RX3 | TX2 | RX2 | TX1 | RX1 | SDA | SCL | COMMUNICATION | 28 | 5V Bus | 30 | 31 | 32 | 33 | Arduino Mega ProtoShield | 34 | 35 | 36 | 37 | 38 | 39 | 40 | 41 | DIGITAL | 42 | 43 | 44 | 45 | 46 | 47 | 48 | 49 | 50 | 51 | 52 | 53 | 3.3 | GND Bus | ANALOG IN | 0 | 1 | 2 | 3 | 4 | 5 | 6 | 7 | 8 | 9 | 10 | 11 | 12 | 13 | 14 | 15 | GND | RES | 5V | GND | VIN | RESET | STAT | POWER